# EAGLE design cosv-carrier-teensy40 (EAGLE 9.6.2)
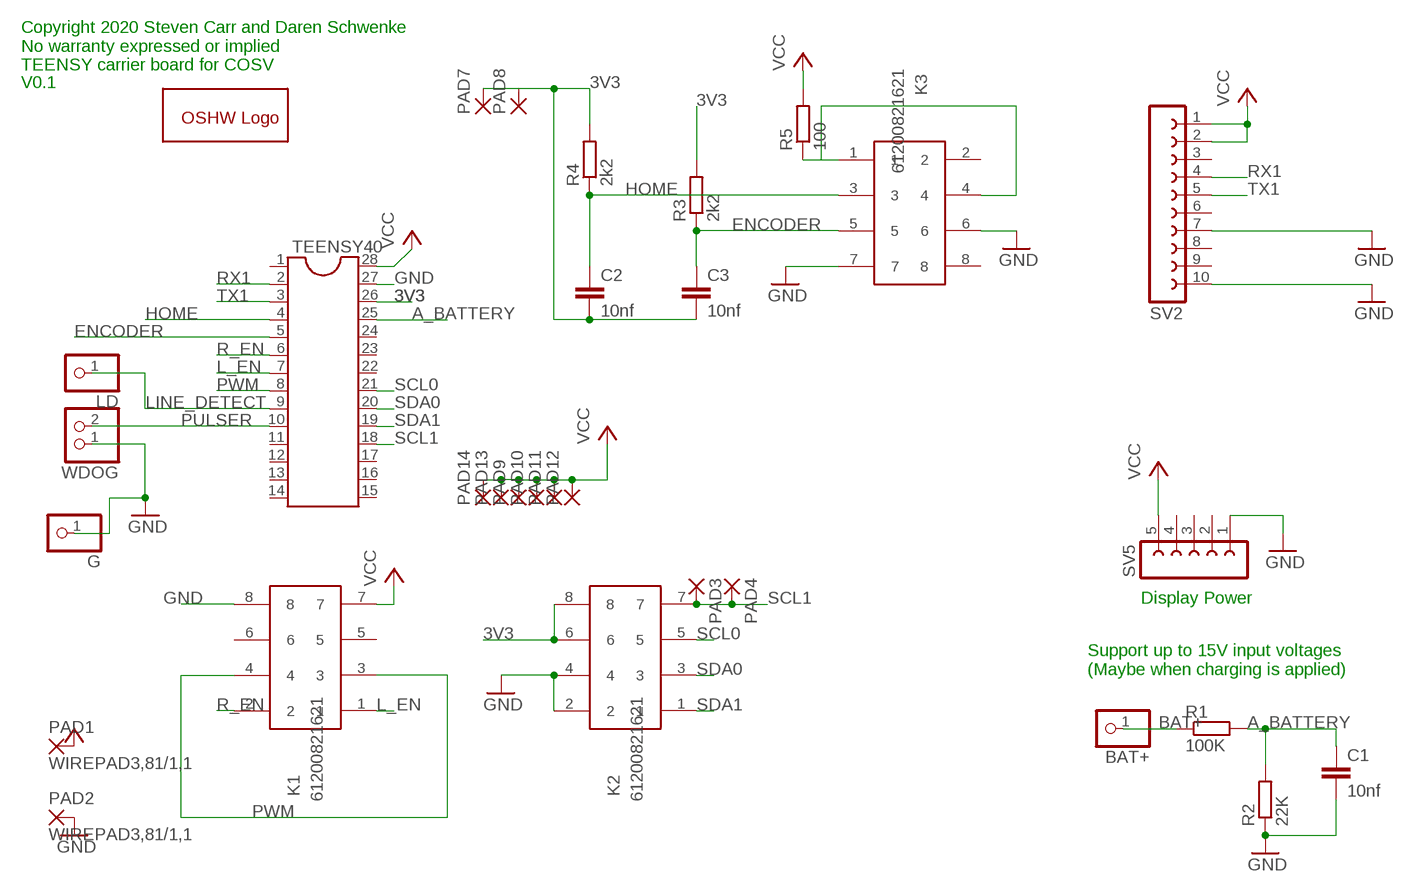
[diagram p0: schematic, sheet 1]

## Parts
BAT+  PINHD-1X01_2.54-S  [1X01-S]
C1  10nf  C-EUC1206  [C1206]
C2  10nf  C-EUC1206  [C1206]
C3  10nf  C-EUC1206  [C1206]
G  PINHD-1X01_2.54-S  [1X01-S]
GOLD_ORB_SM1  OSHWLOGOLOGO8MM  [OSHW_8MM]
K1  61200821621  [61200821621]
K2  61200821621  [61200821621]
K3  61200821621  [61200821621]
LD  PINHD-1X01_2.54-S  [1X01-S]
PAD1  WIREPAD3,81/1,1  [3,81/1,1]
PAD2  WIREPAD3,81/1,1  [3,81/1,1]
PAD3  1,6/0,9  [1,6/0,9]
PAD4  1,6/0,9  [1,6/0,9]
PAD7  1,6/0,9  [1,6/0,9]
PAD8  1,6/0,9  [1,6/0,9]
PAD9  1,6/0,9  [1,6/0,9]
PAD10  1,6/0,9  [1,6/0,9]
PAD11  1,6/0,9  [1,6/0,9]
PAD12  1,6/0,9  [1,6/0,9]
PAD13  1,6/0,9  [1,6/0,9]
PAD14  1,6/0,9  [1,6/0,9]
R1  100K  R-EU_R1206  [R1206]
R2  22K  R-EU_R1206  [R1206]
R3  2k2  R-EU_R1206  [R1206]
R4  2k2  R-EU_R1206  [R1206]
R5  100  R-EU_R1206  [R1206]
SV2  FE10-1  [FE10]
SV5  FE05W  [FE05W]
TEENSY40  DIL28  [DIL28-6]
WDOG  PINHD-1X2  [1X02]

## Nets
3V3: C2.2 C3.2 K2.6 K2.8 PAD7.1(P) PAD8.1(P) R3.2 R4.2 TEENSY40.26
A_BATTERY: C1.1 R1.2 R2.2 TEENSY40.25
BAT+: BAT+.1 R1.1
ENCODER: C3.1 K3.5 R3.1 TEENSY40.5
GND: C1.2 G.1 K1.8 K2.2 K2.4 K3.6 K3.7 PAD2.1(P) R2.1 SV2.7 SV2.10 SV5.1 TEENSY40.27 WDOG.1
HOME: C2.1 K3.3 R4.1 TEENSY40.4
L_EN: K1.1 TEENSY40.7
LED: K3.1 K3.4 R5.1
LINE_DETECT: LD.1 TEENSY40.9
PULSER: TEENSY40.10 WDOG.2
PWM: K1.3 K1.4 TEENSY40.8
R_EN: K1.2 TEENSY40.6
RX1: SV2.4 TEENSY40.2
SCL0: K2.5 TEENSY40.21
SCL1: K2.7 PAD3.1(P) PAD4.1(P) TEENSY40.18
SDA0: K2.3 TEENSY40.20
SDA1: K2.1 TEENSY40.19
TX1: SV2.5 TEENSY40.3
VCC: K1.7 PAD1.1(P) PAD9.1(P) PAD10.1(P) PAD11.1(P) PAD12.1(P) PAD13.1(P) PAD14.1(P) R5.2 SV2.1 SV2.2 SV5.5 TEENSY40.28
Unconnected: K1.5 K1.6 K3.2 K3.8 SV2.3 SV2.6 SV2.8 SV2.9 SV5.2 SV5.3 SV5.4 TEENSY40.1 TEENSY40.11 TEENSY40.12 TEENSY40.13 TEENSY40.14 TEENSY40.15 TEENSY40.16 TEENSY40.17 TEENSY40.22 TEENSY40.23 TEENSY40.24

## Notes on the sheet
- Copyright 2020 Steven Carr and Daren Schwenke
  No warranty expressed or implied
  TEENSY carrier board for COSV
- V0.1
- Display Power
- Support up to 15V input voltages
  (Maybe when charging is applied)

## Library data of the parts
BAT+ G LD = pinhead-2:PINHD-1X01: PIN HEADER
C1-C3 = rcl:C-EU: CAPACITOR, European symbol
GOLD_ORB_SM1 = oshw:OSHWLOGO: The OSHW logo for PCB layout
K1-K3 = Wuerth_Elektronik_eiCan_05_Box_Header_IDC_Connectors_1_2:61200821621: WR-BHD 2.54mm Male Box Header, 8 Pins
PAD1 PAD2 = wirepad:WIREPAD: Wire PAD connect wire on PCB
PAD3 PAD4 PAD7-PAD14 = wirepad:1,6/0,9: THROUGH-HOLE PAD
R1-R5 = resistor:R-EU_: RESISTOR, European symbol
SV2 = con-lsta:FE10-1: FEMALE HEADER; OC_FARNELL: unknown; OC_NEWARK: unknown
SV5 = con-lsta:FE05W: FEMALE HEADER; OC_FARNELL: unknown; OC_NEWARK: unknown
TEENSY40 = ic-package:DIL28: Dual In Line
WDOG = pinhead:PINHD-1X2: PIN HEADER

## Board
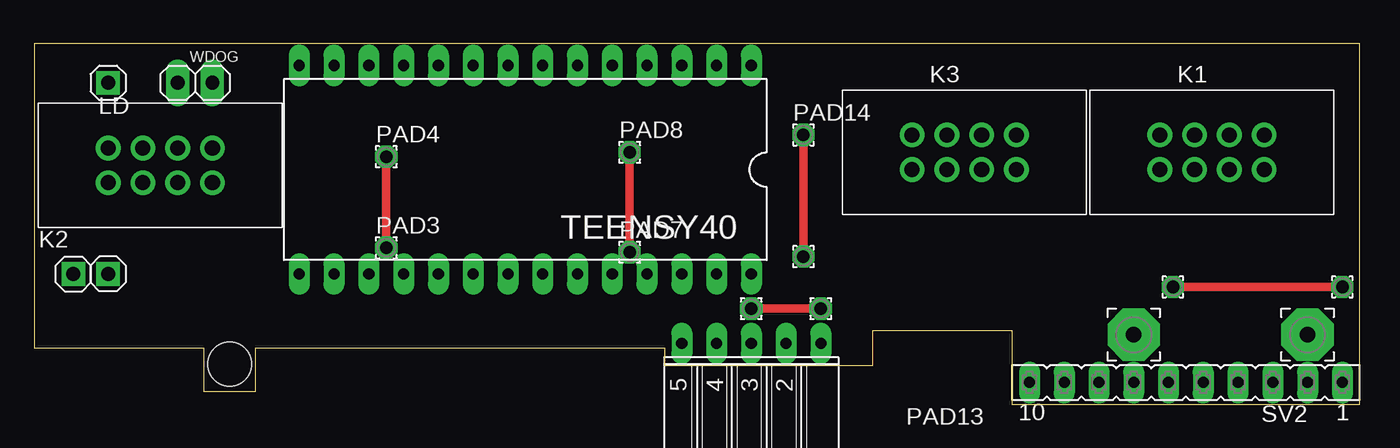
[diagram p1: board, top side]
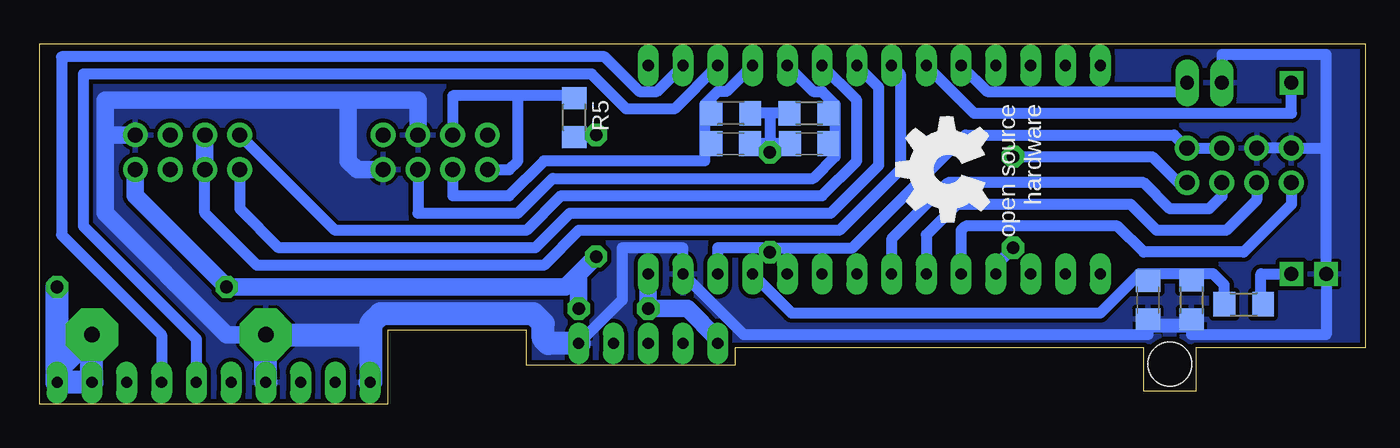
[diagram p2: board, bottom side, seen from below]

Size 96.84 x 26.35 mm. Coordinates in mm from the lower left corner, seen from the top.
Outline: 0,4.13 12.38,4.13 12.38,0.95 16.19,0.95 16.19,4.13 46.04,4.13 46.04,2.86 61.28,2.86 61.28,5.4 71.44,5.4 71.44,0 96.84,0 96.84,26.34 7,26.34 6.98,26.35 0,26.35 0,4.13
Copper layers (1*16): Top 0.035559375mm / dielectric 1.6mm / Bottom 0.035559375mm
Design rules "oshpark-2layer *": minimum track width 6mil, minimum drill 10mil, track to track 5mil, track to pad 5mil, pad to pad 5mil, via to via 5mil, smd to smd 5mil, copper to edge 15mil, drill to drill 6mil, minimum pad ring 14mil, minimum via ring 5mil, stop-mask expansion 2.5mil, vias tented up to drill 0mil, thermal gap 10mil
Holes 3.2 mm at 14.29,2.93

### Footprints (pad centres in the part's own frame; a part is rotated, then mirrored left to right if it is on the bottom)
1X01-S = drill 1.016 square: 1 0,0
C1206 = smd 1.6 x 1.8: 1 -1.4,0; 2 1.4,0
61200821621 = drill 1.1: 1 -2.54,-1.27; 2 -2.54,1.27; 3 0,-1.27; 4 0,1.27; 5 2.54,-1.27; 6 2.54,1.27; 7 5.08,-1.27; 8 5.08,1.27
3,81/1,1 = drill 1.118 pad 3.81 octagon: 1 0,0
1,6/0,9 = drill 0.914 pad 1.6 octagon: 1 0,0
R1206 = smd 1.6 x 1.803: 1 -1.422,0; 2 1.422,0
FE10 = drill 0.813 long: 1 -11.43,0; 2 -8.89,0; 3 -6.35,0; 4 -3.81,0; 5 -1.27,0; 6 1.27,0; 7 3.81,0; 8 6.35,0; 9 8.89,0; 10 11.43,0
FE05W = drill 0.813 long: 1 -5.08,0; 2 -2.54,0; 3 0,0; 4 2.54,0; 5 5.08,0
DIL28-6 = drill 0.813 long: 1 -16.51,-7.62; 2 -13.97,-7.62; 3 -11.43,-7.62; 4 -8.89,-7.62; 5 -6.35,-7.62; 6 -3.81,-7.62; 7 -1.27,-7.62; 8 1.27,-7.62; 9 3.81,-7.62; 10 6.35,-7.62; 11 8.89,-7.62; 12 11.43,-7.62; 13 13.97,-7.62; 14 16.51,-7.62; 15 16.51,7.62; 16 13.97,7.62; 17 11.43,7.62; 18 8.89,7.62; 19 6.35,7.62; 20 3.81,7.62; 21 1.27,7.62; 22 -1.27,7.62; 23 -3.81,7.62; 24 -6.35,7.62; 25 -8.89,7.62; 26 -11.43,7.62; 27 -13.97,7.62; 28 -16.51,7.62
1X02 = drill 1.016 long: 1 -1.27,0; 2 1.27,0

### Placement (x,y rotation side)
BAT+  5.4,9.53 270 top
C1  15.88,7.62 270 bottom
C2  46.35,19.05 0 bottom
C3  40.64,19.05 180 bottom
G  2.86,9.53 90 top
GOLD_ORB_SM1  30.48,17.14 90 bottom
K1  84.77,18.41 0 top
K2  7.94,17.46 0 top
K3  66.67,18.41 0 top
LD  5.4,23.49 0 top
PAD1  93.03,5.08 0 top
PAD2  80.33,5.08 0 top
PAD3  25.72,11.43 0 top
PAD4  25.72,18.1 0 top
PAD7  43.5,11.11 0 top
PAD8  43.5,18.41 0 top
PAD9  52.39,6.99 0 top
PAD10  57.47,6.99 0 top
PAD11  83.18,8.57 0 top
PAD12  95.57,8.57 0 top
PAD13  56.2,10.79 0 top
PAD14  56.2,19.68 0 top
R1  8.89,7.3 180 bottom
R2  12.7,7.62 90 bottom
R3  40.64,21.27 180 bottom
R4  46.35,21.27 0 bottom
R5  57.79,20.95 270 bottom
SV2  84.14,1.59 180 top
SV5  52.39,4.44 180 top
TEENSY40  35.88,17.14 180 top
WDOG  11.75,23.49 0 top

### Tracks (layer width: path | path; a pad name or v marks a point on that pad's centre or on a via)
3V3
  Top 0.61: PAD8.1 PAD7.1
  Bottom 0.813: R3.2 43.5,21.27 | 43.5,21.27 R4.2 | C3.2 43.5,19.05 | 43.5,19.05 C2.2 | 43.5,21.27 43.5,19.05 | PAD8.1 43.5,19.05 | TEENSY40.26 47.31,11.43 43.81,11.43 PAD7.1 43.18,11.43 37.47,11.43 29.21,19.68 13.97,19.68 K2.8 K2.6
A_BATTERY
  Bottom 0.813: TEENSY40.25 41.91,6.67 19.37,6.67 16.51,9.53 15.87,9.53 | 12.72,9.02 R2.2 12.7,9.53 | R1.2 10.31,8.73 11.11,9.53 12.7,9.53 | 12.7,9.53 15.87,9.53 | C1.1 15.87,9.53
BAT+
  Bottom 0.813: BAT+.1 7.62,9.53 7.62,7.45 R1.1
ENCODER
  Bottom 0.813: K3.5 69.21,13.97 61.91,13.97 59.37,16.51 40.32,16.51 38.73,18.1 38.73,19.05 | TEENSY40.5 40.32,22.86 39.69,22.86 38.73,21.91 38.73,21.27 | 38.73,21.27 38.73,19.05 | C3.1 38.73,19.05 | R3.1 38.73,21.27
GND
  Bottom 0.813: 12.72,6.22 R2.1 12.7,5.71 12.7,5.08 2.86,5.08 G.1 2.86,18.73 | K2.4 K2.2 2.86,18.73 | C1.2 15.87,5.71 15.87,5.08 45.4,5.08 TEENSY40.27 49.85,11.43 54.29,11.43 54.29,7.62 SV5.1 | 2.86,18.73 2.86,25.56 6.66,25.56 6.67,25.55 10.48,25.55 WDOG.1
  Bottom 1.016: 12.7,5.71 15.87,5.71
  Bottom 1.27: 57.47,4.76 SV5.1 | PAD2.1 83.18,5.08 92.07,13.97 92.07,19.68 | 92.07,19.68 92.07,22.22 74.29,22.22 | 74.29,22.22 69.21,22.22 K3.6 | K3.7 73.66,17.14 74.29,17.78 74.29,22.22 | K1.8 92.07,19.68
  Bottom 1.676: SV5.1 59.69,4.44 60.06,4.81 60.06,5.9 60.77,6.62 71.94,6.62 72.66,5.9 72.66,5.08 | SV2.10 72.66,1.64 72.66,5.08 | 72.66,5.08 PAD2.1 SV2.7
  Bottom 1.778: SV5.1 57.5,4.41
  pour Bottom (isolate 0.305): 0,4.13 0,26.35 96.84,26.35 96.84,0 71.44,0 71.44,5.4 61.28,5.4 61.28,2.86 46.04,2.86 46.04,4.13
HOME
  Bottom 0.813: K3.3 66.68,15.24 62.55,15.24 60.01,17.78 48.26,17.78 48.26,19.05 | 47.78,19.07 C2.1 48.26,19.05 | TEENSY40.4 46.67,22.86 47.31,22.86 48.26,21.91 48.26,21.27 | 48.26,21.27 48.26,19.05 | R4.1 48.26,21.27
L_EN
  Bottom 0.813: K1.1 82.23,14.29 79.38,11.43 60.64,11.43 58.1,13.97 39.05,13.97 35.56,17.46 35.56,23.18 TEENSY40.7
LED
  Bottom 0.813: 61.91,22.54 66.68,22.54 K3.4 | K3.1 62.55,17.14 61.91,17.78 61.91,22.54 | R5.1 57.95,22.54 61.91,22.54
LINE_DETECT
  Bottom 0.813: TEENSY40.9 28.58,21.27 5.4,21.27 LD.1
PULSER
  Bottom 0.813: TEENSY40.10 27.62,22.86 13.02,22.86 WDOG.2
PWM
  Bottom 0.813: TEENSY40.8 33.97,24.13 33.97,17.14 38.42,12.7 57.47,12.7 60.01,10.16 80.96,10.16 84.77,13.97 K1.3
  Bottom 1.27: K1.3 K1.4
R_EN
  Bottom 0.813: TEENSY40.6 37.15,22.22 37.15,17.78 39.69,15.24 58.74,15.24 61.28,12.7 75.25,12.7 K1.2
RX1
  Bottom 0.813: TEENSY40.2 51.75,22.86 53.02,22.86 55.56,25.4 95.25,25.4 95.25,12.38 87.95,5.08 SV2.4
SCL0
  Bottom 0.813: K2.5 10.48,15.22 11.42,14.28 14.27,14.28 16.19,16.19 30.48,16.19 34.61,12.07 TEENSY40.21
SCL1
  Top 0.61: PAD4.1 PAD3.1
  Bottom 0.813: K2.7 13.65,16.19 15.56,18.1 PAD4.1 | TEENSY40.18 26.99,10.16 PAD3.1
SDA0
  Bottom 0.813: K2.3 7.94,14.92 10.16,12.7 15.24,12.7 17.14,14.61 29.84,14.61 32.07,12.38 TEENSY40.20
SDA1
  Bottom 0.813: K2.1 5.4,14.61 8.89,11.11 16.19,11.11 18.1,13.02 29.21,13.02 29.53,12.7 TEENSY40.19
TX1
  Bottom 0.813: SV2.5 85.41,4.76 93.66,13.02 93.66,24.13 56.52,24.13 53.98,21.59 50.48,21.59 TEENSY40.3
VCC
  Top 0.61: PAD14.1 PAD13.1 | PAD12.1 PAD11.1 | PAD9.1 PAD10.1
  Bottom 0.813: R5.2 56.35,19.53 PAD14.1
  Bottom 1.016: PAD11.1 83.5,8.57
  Bottom 1.27: PAD13.1 57.47,9.53 | 57.47,9.53 58.42,8.57 PAD11.1 89.85,15.24 K1.7 | SV5.5 47.31,4.76 49.53,6.99 PAD9.1 TEENSY40.28 | PAD10.1 57.47,9.53
  Bottom 1.676: SV2.1 SV2.2 PAD1.1 95.57,2.54 SV2.1 | SV2.1 PAD12.1

### Text on the board
tValues: gnd | gnd | scl1 | 3v3 | scl0 | gnd | sda0 | vcc | 3v3 | gnd | gnd | gnd | sda1
bValues: TEENSY 4.0 Carrier Board for COSV / (c) 2020 Steven Carr and Daren Schwenke | V0.1